# EasyEDA schematic SCH TOP BOARD.json
TITLE: Sheet_1; REV: 1.0; Date: 2022-10-06; Sheet: 1/1; Drawn By: evolutiontechnologyindonesia; Company: Your Company
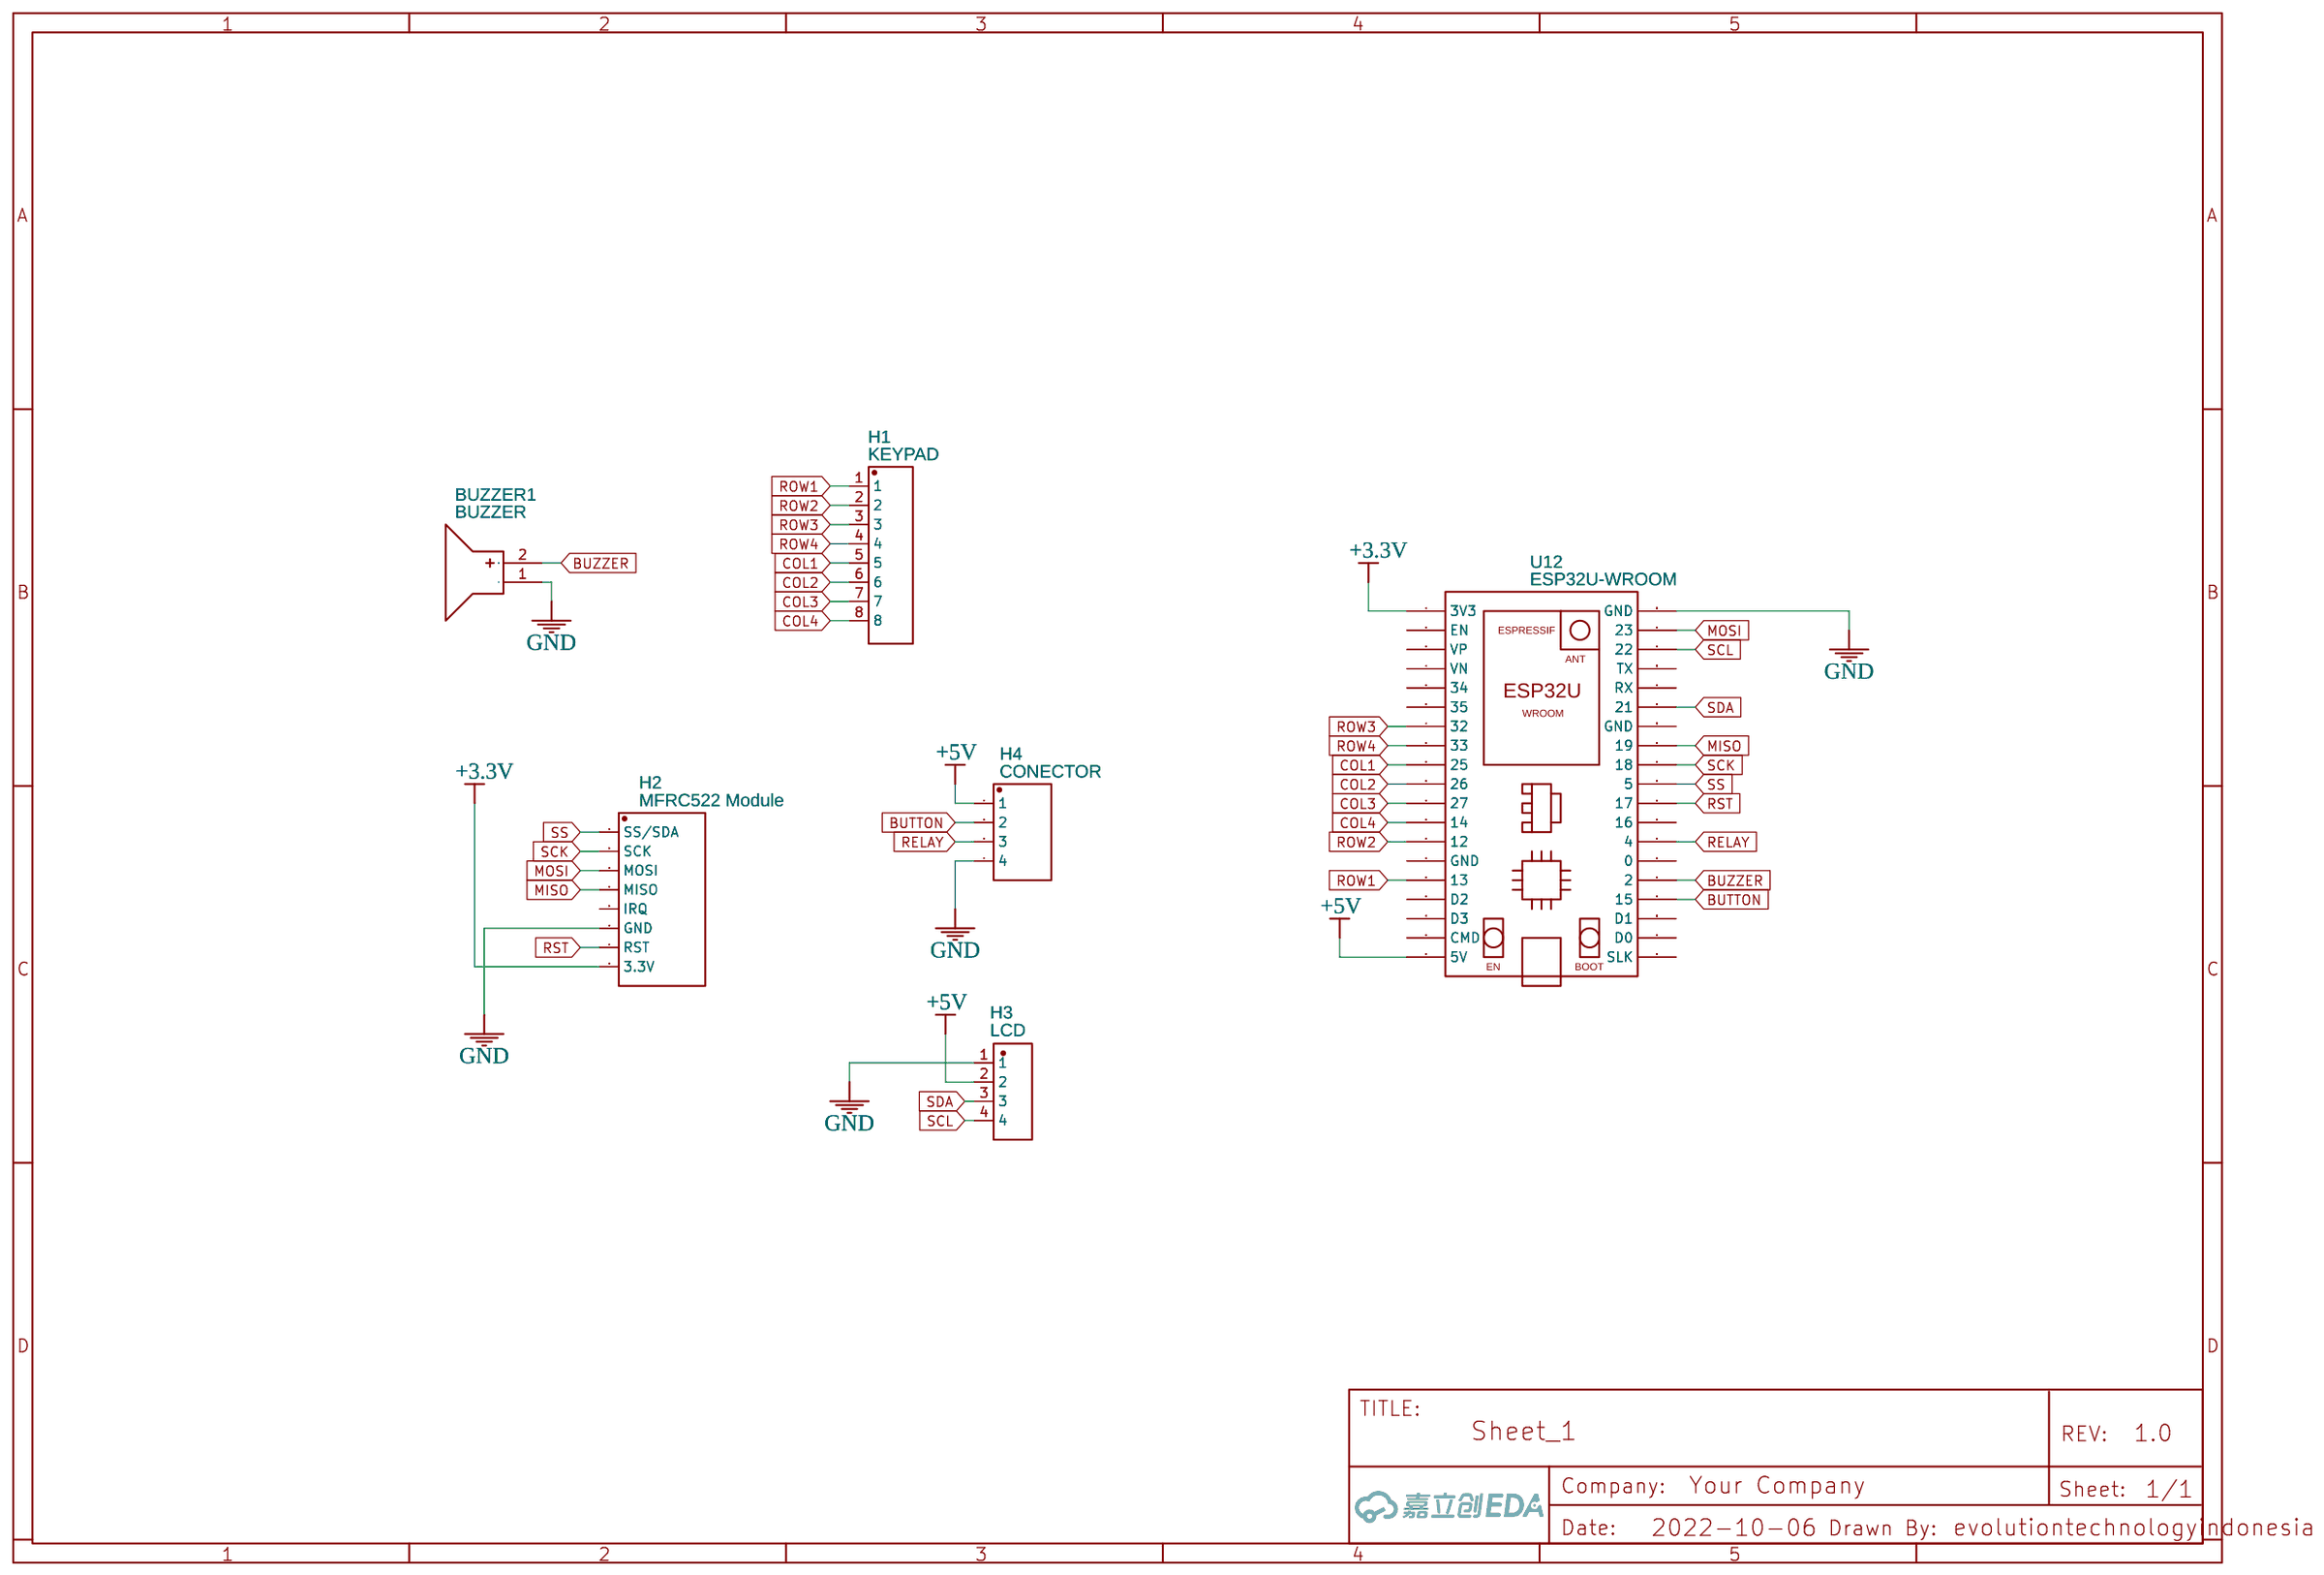
[diagram p0: schematic sheet]

## Parts
BUZZER1  BUZZER  [BUZ-TH_BD12.0-P6.00-D0.9-RD]
H1  KEYPAD  [HDR-TH_8P-P2.54-V-F-1]
H2  MFRC522 Module  [MFRC522]
H3  LCD  [HDR-TH_4P-P2.54-V-M]
H4  CONECTOR  [HDR-TH_4P-P2.54-V-M]
U12  ESP32U-WROOM  [ESP32U-WROOM]

## Library data of the parts
BUZZER1 = BUZZER: Supplier: LCSC; Supplier Part: C9900014030; Manufacturer: null; Manufacturer Part: buzzer; JLCPCB Part Class: Extended Part; Contributor: lcsc
H1 = 220S-1*8P H=8.5MM Ytype Gold-plated: Supplier: LCSC; Manufacturer: Ckmtw; Contributor: LCSC; Supplier Part: C124416; JLCPCB Part Class: Extended Part
H2 = MFRC522 Module: Manufacturer: Ckmtw; Manufacturer Part: 210S-1*8P L=11.6MMGold-plated black; Contributor: Nicolas Fourgheon
H3 = PZ254-1-04-Z-8.5: Supplier: LCSC; Supplier Part: C2894927; Manufacturer: HCTL(华灿天禄); Contributor: LCSC; JLCPCB Part Class: Extended Part
H4 = Header-Male-2.54_1x4: Supplier: LCSC; Manufacturer: Ckmtw(灿科盟); Manufacturer Part: B-2100S04P-A110; Contributor: LCSC; Supplier Part: C124378; JLCPCB Part Class: Extended Part
U12 = ESP32U-WROOM: Supplier: ESPRESSIF; Contributor: DEVAZ

## Nets
+3.3V: H2.8(3.3V) U12.1(3V3)
+5V: H3.2 H4.1 U12.19(5V)
GND: BUZZER1.1(-) H2.6(GND) H3.1 H4.4 U12.20(GND)
BUTTON: H4.2 U12.35(15)
BUZZER: BUZZER1.2(+) U12.34(2)
COL1: H1.5 U12.9(25)
COL2: H1.6 U12.10(26)
COL3: H1.7 U12.11(27)
COL4: H1.8 U12.12(14)
MISO: H2.4(MISO) U12.27(19)
MOSI: H2.3(MOSI) U12.21(23)
RELAY: H4.3 U12.32(4)
ROW1: H1.1 U12.15(13)
ROW2: H1.2 U12.13(12)
ROW3: H1.3 U12.7(32)
ROW4: H1.4 U12.8(33)
RST: H2.7(RST) U12.30(17)
SCK: H2.2(SCK) U12.28(18)
SCL: H3.4 U12.22
SDA: H3.3 U12.25(21)
SS: H2.1(SS/SDA) U12.29(5)

Not connected (* = marked no-connect by the designer): H2 5(IRQ); U12 2(EN) 3(VP) 4(VN) 5(34) 6(35) 14(GND) 16(D2) 17(D3) 18(CMD) 23(TX) 24(RX) 26(GND) 31(16) 33(0) 36(D1) 37(D0) 38(SLK)
